# Altium schematic sheet Sheet1.SchDoc
size A2
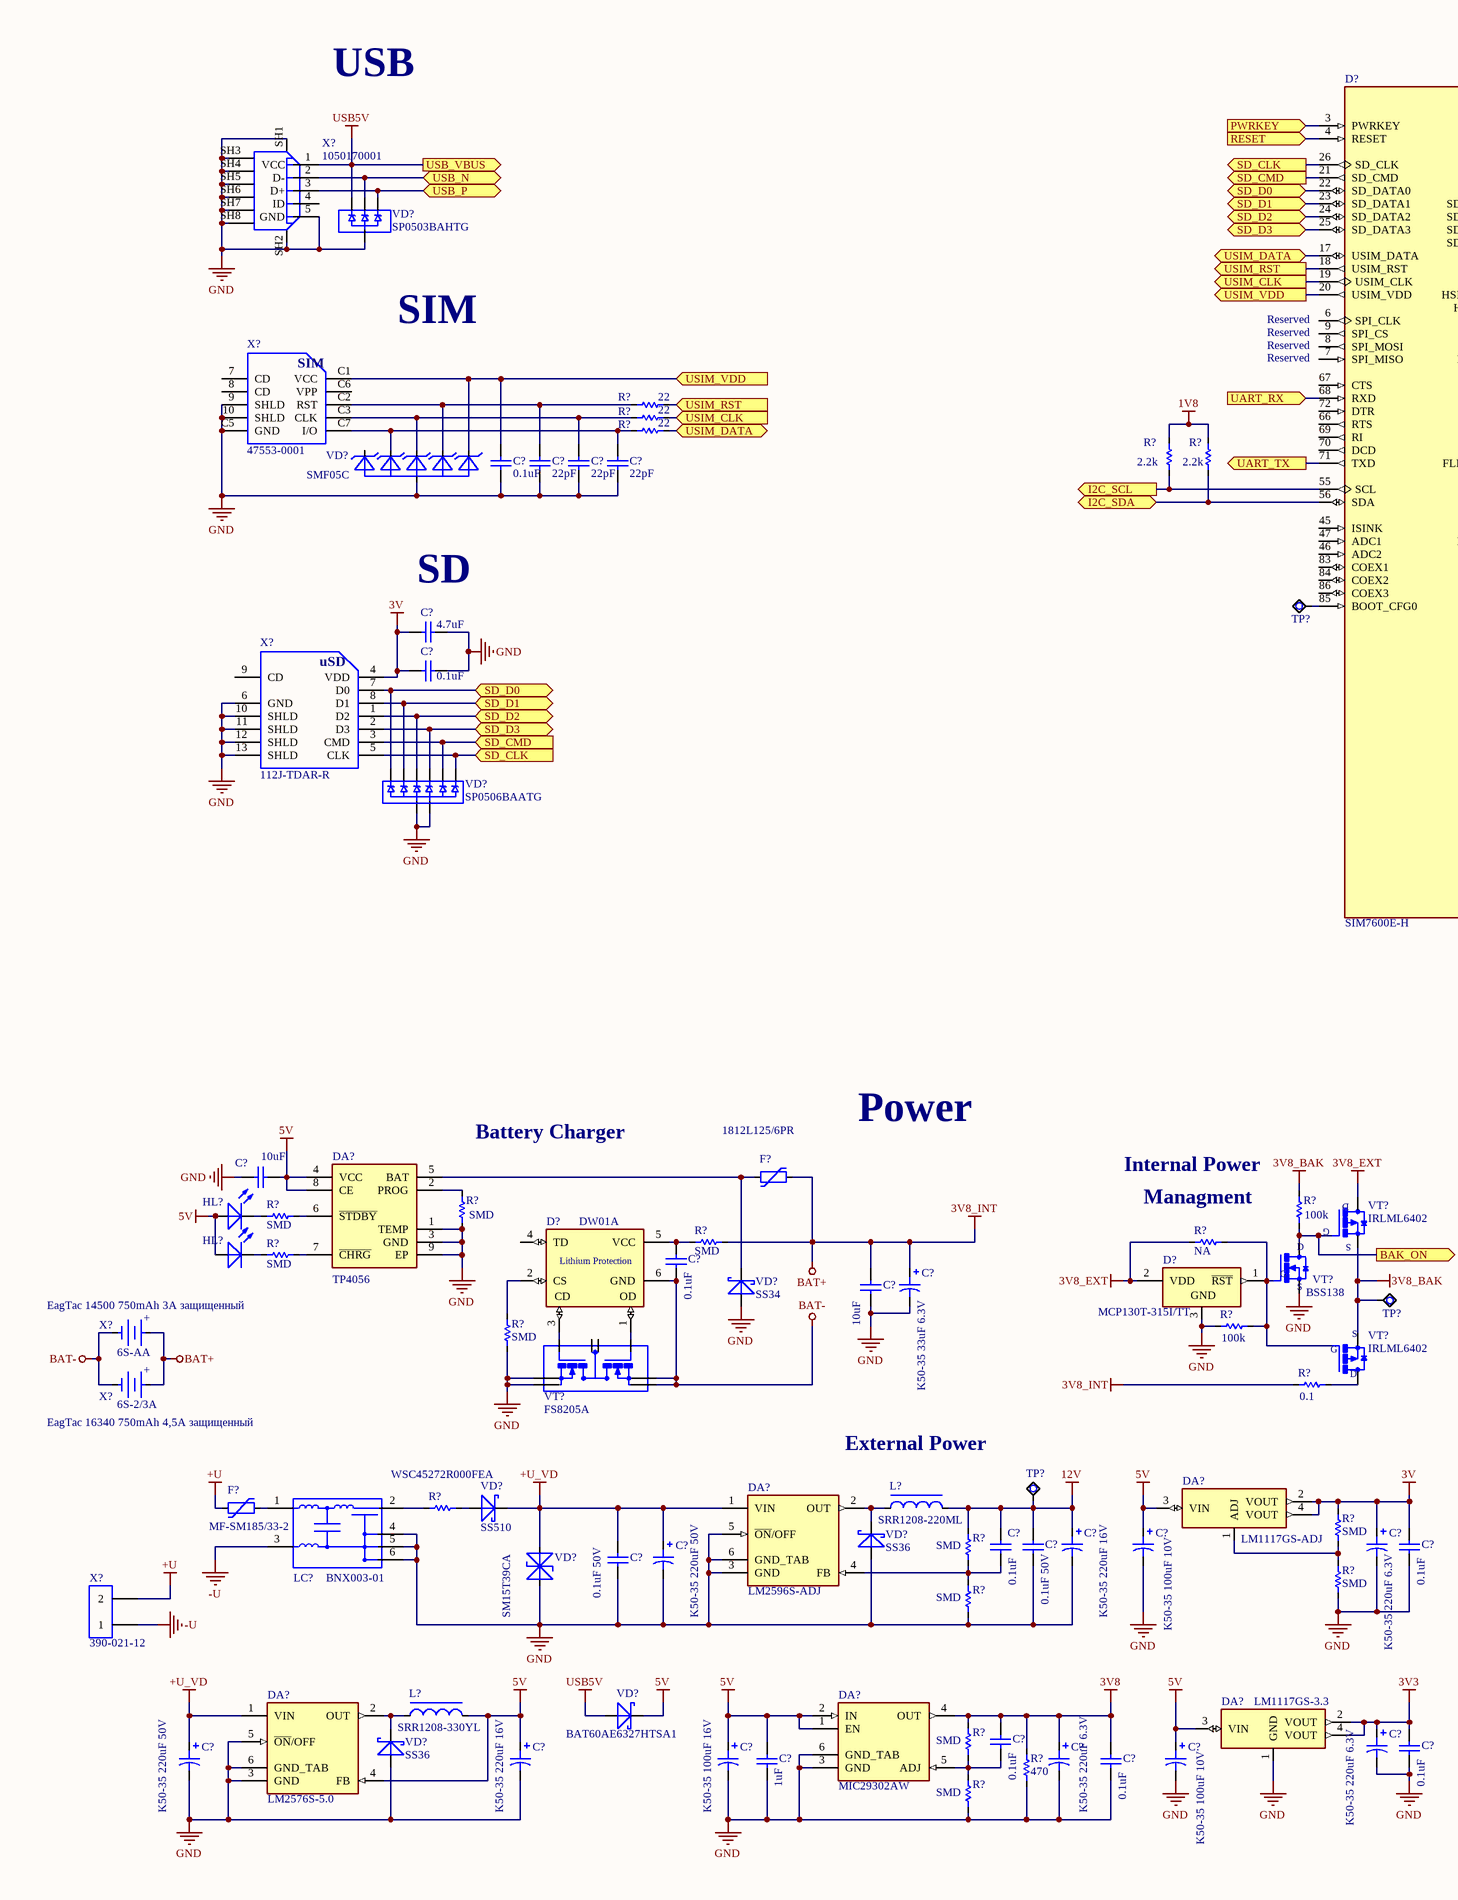
[diagram p0: Sheet1.SchDoc, left]
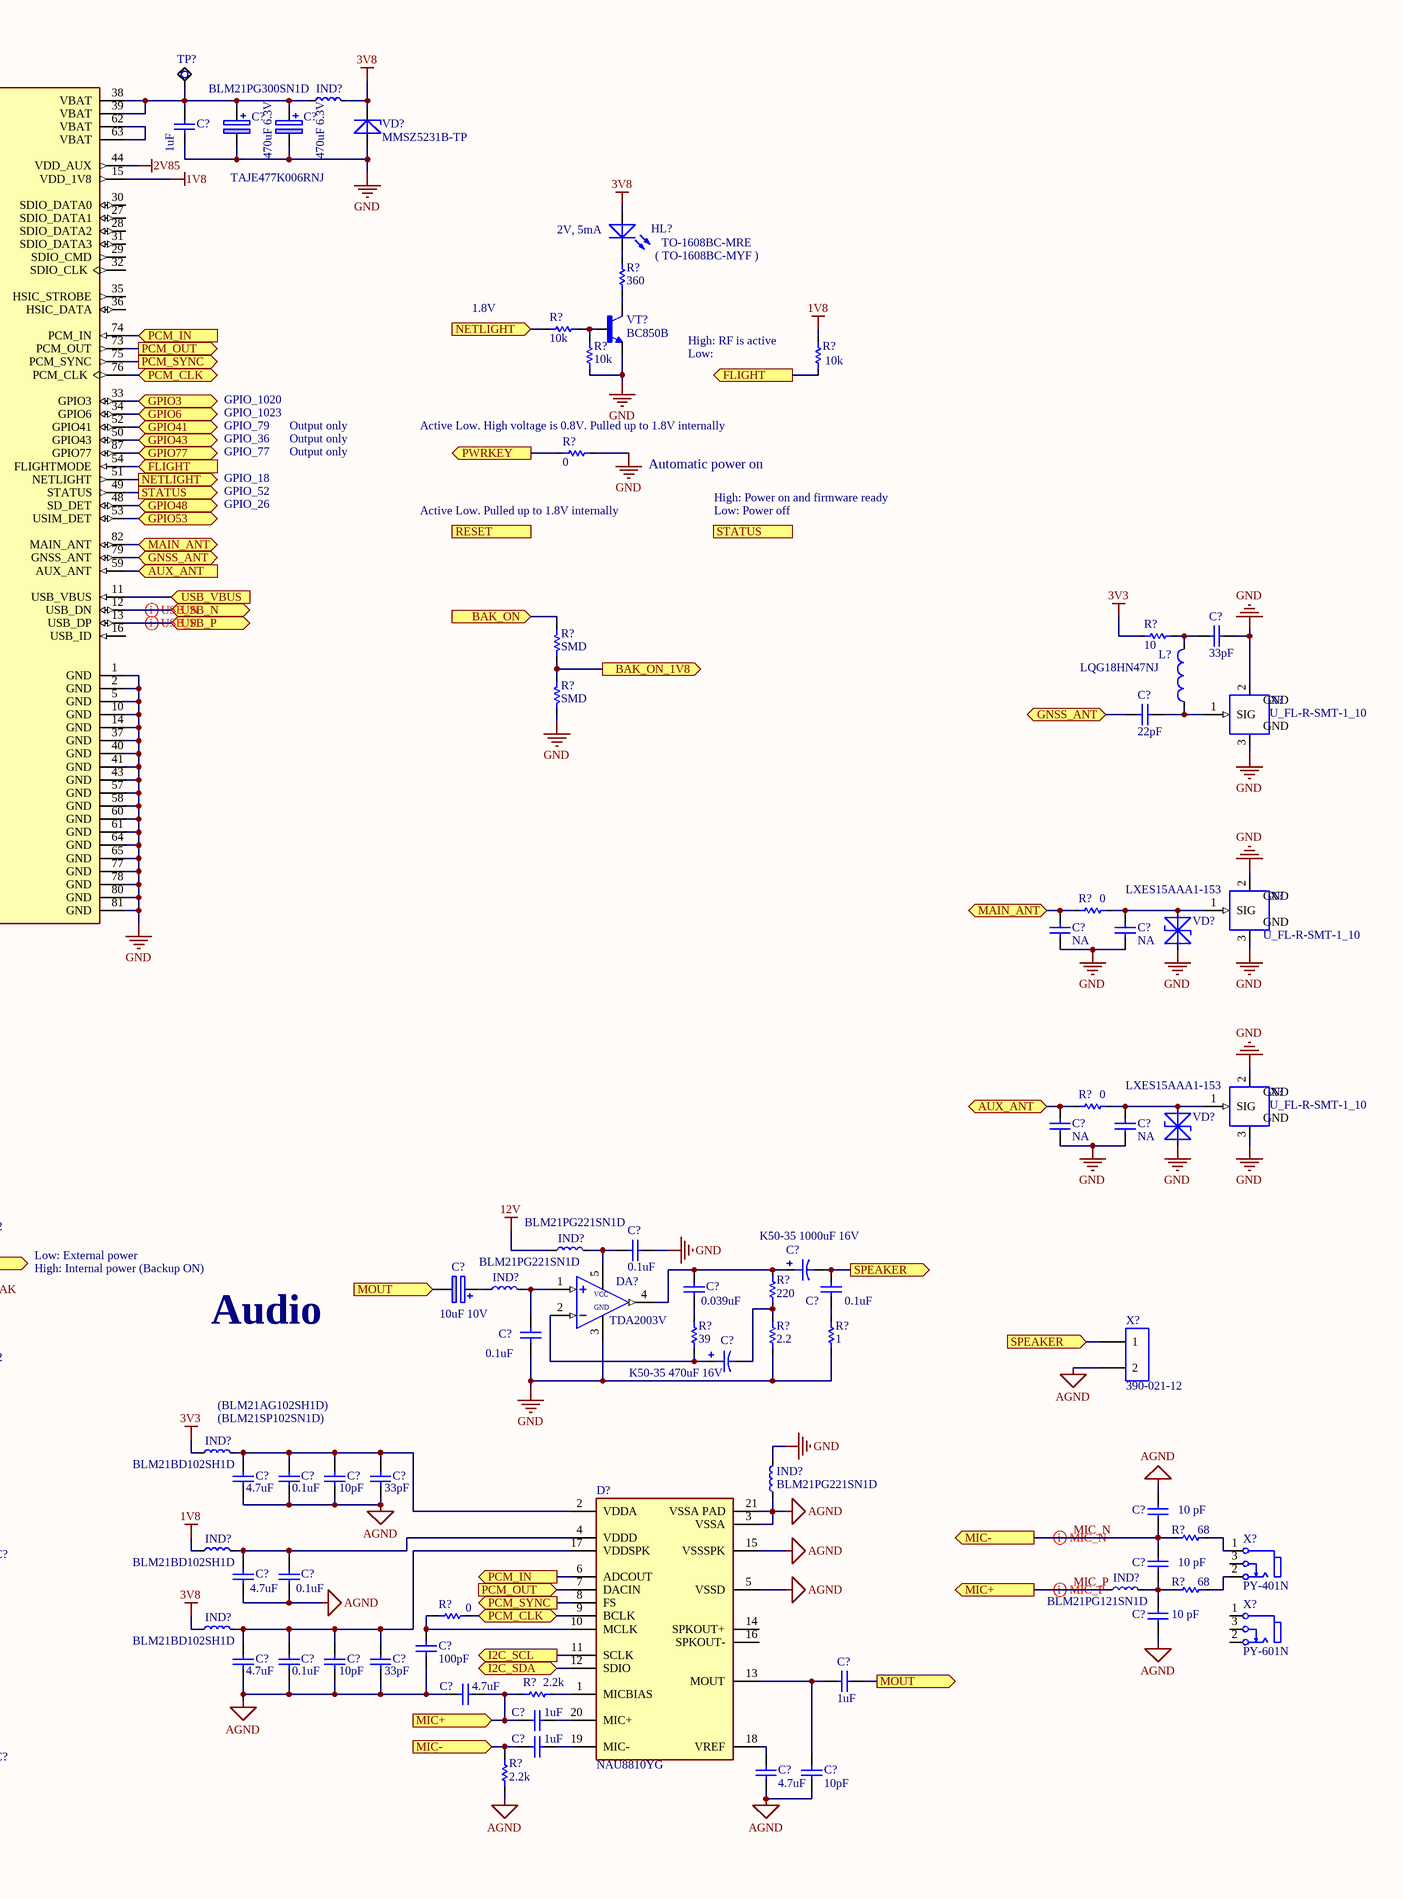
[diagram p1: Sheet1.SchDoc, right]

## Parts
(Parts that share a designator on the sheet are numbered #1, #2 ... from top to bottom, then left to right.)
C?#1  1uF  [C_SMD0603]
C?#2  470uF 6.3V  [TECAP_A]
C?#3  470uF 6.3V  [TECAP_A]
C?#4  0.1uF  [C_SMD0603]
C?#5  22pF  [C_SMD0603]
C?#6  22pF  [C_SMD0603]
C?#7  22pF  [C_SMD0603]
C?#8  33pF  [C_SMD0603]
C?#9  4.7uF  [C_SMD0603]
C?#10  0.1uF  [C_SMD0603]
C?#11  22pF  [C_SMD0603]
C?#12  NA  [C_SMD0603]
C?#13  NA  [C_SMD0603]
C?#14  NA  [C_SMD0603]
C?#15  NA  [C_SMD0603]
C?#16  10uF  [C_SMD0603]
C?#17  0.1uF  [C_SMD0603]
C?#18  0.1uF  [C_SMD0603]
C?#19  0.039uF  [C_SMD0603]
C?#20  K50-35 1000uF 16V  [K50-35 10x12.5x5]
C?#21  0.1uF  [C_SMD0603]
C?#22  10uF  [C_SMD0603]
C?#23  10uF 10V  [TECAP_B]
C?#24  K50-35 33uF 6.3V  [K50-35mini 4x7x2]
C?#25  0.1uF  [C_SMD0603]
C?#26  K50-35 470uF 16V  [K50-35 8x11.5x3.5]
C?#27  4.7uF  [C_SMD0603]
C?#28  0.1uF  [C_SMD0603]
C?#29  10pF  [C_SMD0603]
C?#30  33pF  [C_SMD0603]
C?#31  10 pF  [C_SMD0603]
C?#32  0.1uF  [C_SMD0603]
C?#33  0.1uF 50V  [C_SMD0603]
C?#34  0.1uF  [C_SMD0603]
C?#35  10 pF  [C_SMD0603]
C?#36  0.1uF 50V  [C_SMD0603]
C?#37  4.7uF  [C_SMD0603]
C?#38  0.1uF  [C_SMD0603]
C?#39  K50-35 220uF 16V  [K50-35 6.3x11x2.5]
C?#40  K50-35 100uF 10V  [K50-35 5x11x2]
C?#41  K50-35 220uF 6.3V  [K50-35 6.3x11x2.5]
C?#42  K50-35 220uF 50V  [K50-35 10x12.5x5]
C?#43  10 pF  [C_SMD0603]
C?#44  4.7uF  [C_SMD0603]
C?#45  0.1uF  [C_SMD0603]
C?#46  10pF  [C_SMD0603]
C?#47  33pF  [C_SMD0603]
C?#48  1uF  [C_SMD0603]
C?#49  100pF  [C_SMD0603]
C?#50  4.7uF  [C_SMD0603]
C?#51  0.1uF  [C_SMD0603]
C?#52  0.1uF  [C_SMD0603]
C?#53  1uF  [C_SMD0603]
C?#54  1uF  [C_SMD0603]
C?#55  0.1uF  [C_SMD0603]
C?#56  1uF  [C_SMD0603]
C?#57  K50-35 220uF 6.3V  [K50-35 6.3x11x2.5]
C?#58  K50-35 220uF 50V  [K50-35 10x12.5x5]
C?#59  K50-35 220uF 16V  [K50-35 6.3x11x2.5]
C?#60  K50-35 100uF 16V  [K50-35 6.3x11x2.5]
C?#61  K50-35 220uF 6.3V  [K50-35 6.3x11x2.5]
C?#62  K50-35 100uF 10V  [K50-35 5x11x2]
C?#63  4.7uF  [C_SMD0603]
C?#64  10pF  [C_SMD0603]
D?#1  SIM7600E-H  [IC_SIM7600E-H]
D?#2  DW01A  [SOT23-6-D]
D?#3  MCP130T-315I/TT  [SOT23-3]
D?#4  NAU8810YG  [NAU8810YG]
DA?#1  TP4056  [SOIC127P600X175-9N]
DA?#2  TDA2003V  [TDA2003V]
DA?#3  LM2596S-ADJ  [TO263-5]
DA?#4  LM1117GS-ADJ  [SOT223]
DA?#5  LM2576S-5.0  [TO263-5]
DA?#6  MIC29302AW  [TO-252-5]
DA?#7  LM1117GS-3.3  [SOT223]
F?#1  1812L125/6PR  [FUSSC324X455X62L]
F?#2  MF-SM185/33-2  [FUSM8867X300N]
HL?#1  TO-1608BC-MRE  [LED_SMD1608]
HL?#2  TO-1608BC-MRE  [LED_SMD1608]  (value not drawn)
HL?#3  TO-1608BC-MRE  [LED_SMD1608]  (value not drawn)
IND?#1  BLM21PG300SN1D  [BLM21PG221_0805]
IND?#2  BLM21PG221SN1D  [BLM21PG221_0805]
IND?#3  BLM21PG221SN1D  [BLM21PG221_0805]
IND?#4  BLM21BD102SH1D  [BLM21PG221_0805]
IND?#5  BLM21PG221SN1D  [BLM21PG221_0805]
IND?#6  BLM21BD102SH1D  [BLM21PG221_0805]
IND?#7  BLM21PG121SN1D  [BLM21PG221_0805]
IND?#8  BLM21BD102SH1D  [BLM21PG221_0805]
L?#1  LQG18HN47NJ  [R_SMD0603]
L?#2  SRR1208-220ML  [SRR1208]
L?#3  SRR1208-330YL  [SRR1208]
LC?  BNX003-01  [Murata_BNX_L12MM5_W11MM5_T13MM0_MFG]
R?#1  360  [R_SMD0603]
R?#2  10k  [R_SMD0603]
R?#3  10k  [R_SMD0603]
R?#4  10k  [R_SMD0603]
R?#5  22  [R_SMD0603]
R?#6  22  [R_SMD0603]
R?#7  0  [R_SMD0603]
R?#8  22  [R_SMD0603]
R?#9  2.2k  [R_SMD0603]
R?#10  2.2k  [R_SMD0603]
R?#11  SMD  [R_SMD0603]
R?#12  10  [R_SMD0603]
R?#13  SMD  [R_SMD0603]
R?#14  0  [R_SMD0603]
R?#15  0  [R_SMD0603]
R?#16  SMD  [R_SMD0603]
R?#17  100k  [R_SMD0603]
R?#18  SMD  [R_SMD0603]
R?#19  SMD  [R_SMD0603]
R?#20  NA  [R_SMD0603]
R?#21  SMD  [R_SMD0603]
R?#22  220  [R_SMD0603]
R?#23  39  [R_SMD0603]
R?#24  2.2  [R_SMD0603]
R?#25  1  [R_SMD0603]
R?#26  SMD  [R_SMD0603]
R?#27  100k  [R_SMD0603]
R?#28  0.1  [R_SMD0805]
R?#29  WSC45272R000FEA  [R_SMD4527]
R?#30  68  [R_SMD0603]
R?#31  SMD  [R_SMD0603]
R?#32  SMD  [R_SMD0603]
R?#33  68  [R_SMD0603]
R?#34  SMD  [R_SMD0603]
R?#35  SMD  [R_SMD0603]
R?#36  0  [R_SMD0603]
R?#37  2.2k  [R_SMD0603]
R?#38  SMD  [R_SMD0603]
R?#39  2.2k  [R_SMD0603]
R?#40  470  [R_SMD0805]
R?#41  SMD  [R_SMD0603]
TP?#1  Test_point  [TEST_POINT]  (value not drawn)
TP?#2  Test_point  [TEST_POINT]  (value not drawn)
TP?#3  Test_point  [TEST_POINT]  (value not drawn)
TP?#4  Test_point  [TEST_POINT]  (value not drawn)
VD?#1  MMSZ5231B-TP  [SOD-123_3716X135N]
VD?#2  SP0503BAHTG  [SP0503BAHTG]
VD?#3  SMF05C  [SMF05C]
VD?#4  SP0506BAATG  [SOP65P490X110-8N]
VD?#5  LXES15AAA1-153  [Murata_LXES15_IPC_A]
VD?#6  LXES15AAA1-153  [Murata_LXES15_IPC_A]
VD?#7  SS34  [DO214AB SMC]
VD?#8  SS510  [SMC]
VD?#9  SS36  [DO214AB SMC]
VD?#10  SM15T39CA  [DO214AB SMC]
VD?#11  BAT60AE6327HTSA1  [SOD-323]
VD?#12  SS36  [DO214AB SMC]
VT?#1  BC850B  [SOT23-3]
VT?#2  IRLML6402  [SOT23]
VT?#3  FS8205A  [SOP65P640X120-8N]
VT?#4  BSS138  [SOT23-3]
VT?#5  IRLML6402  [SOT23]
X?#1  1050170001  [MOLEX_1050170001]
X?#2  47553-0001  [Molex_47553-0001_SIM]
X?#3  112J-TDAR-R  [112JTDARR]
X?#4  U_FL-R-SMT-1_10  [HIROSE_0_MFG]
X?#5  U_FL-R-SMT-1_10  [HIROSE_0_MFG]
X?#6  U_FL-R-SMT-1_10  [HIROSE_0_MFG]
X?#7  6S-AA  [BAT_6S-AA]
X?#8  390-021-12  [390-021-12]
X?#9  6S-2/3A  [BAT_6S-2/3A]
X?#10  PY-401N  [PY-401N]
X?#11  PY-601N  [PY601-N]
X?#12  390-021-12  [390-021-12]

## Ports
AUX_ANT (bidir), AUX_ANT (in), BAK_ON (in), BAK_ON (out), BAK_ON_1V8 (out), FLIGHT (in), FLIGHT (out), GNSS_ANT (bidir), GPIO3 (bidir), GPIO6 (bidir), GPIO41 (bidir), GPIO43 (bidir), GPIO48 (bidir), GPIO53 (bidir), GPIO77 (bidir), I2C_SCL (out), I2C_SDA (bidir), MAIN_ANT (bidir), MIC+ (in), MIC+ (out), MIC- (in), MIC- (out), MOUT (in), MOUT (out), NETLIGHT (in), NETLIGHT (out), PCM_CLK (bidir), PCM_IN (in), PCM_IN (out), PCM_OUT (in), PCM_OUT (out), PCM_SYNC (out), PWRKEY (in), PWRKEY (out), RESET (in), RESET (out), SD_CLK (in), SD_CLK (out), SD_CMD (in), SD_CMD (out), SD_D0 (bidir), SD_D1 (bidir), SD_D2 (bidir), SD_D3 (bidir), SPEAKER (in), SPEAKER (out), STATUS (in), STATUS (out), UART_RX (in), UART_TX (out), USB_N (bidir), USB_P (bidir), USB_VBUS (in), USB_VBUS (out), USIM_CLK (in), USIM_CLK (out), USIM_DATA (bidir), USIM_RST (in), USIM_RST (out), USIM_VDD (in), USIM_VDD (out)

## Nets
1V8: D?#1.15(VDD_1V8) IND?#6.1 R?#4.1(CCW) R?#9.2(CW) R?#10.2(CW)
2V85: D?#1.44(VDD_AUX)
3V: C?#9.2 C?#10.2 C?#34.1 C?#41.1 DA?#4.2(VOUT) DA?#4.4(VOUT) R?#31.2(CW) X?#3.4(VDD)
3V3: C?#52.1 C?#57.1 DA?#7.2(VOUT) DA?#7.4(VOUT) IND?#4.1 R?#12.2(CW)
3V8: C?#51.1 C?#55.1 C?#61.1 DA?#6.4(OUT) HL?#1.1(POS) IND?#1.2 IND?#8.1 R?#38.2(CW) R?#40.2(CW) VD?#1.C(NEG)
3V8_BAK: R?#17.1(CCW) TP?#3.1 VT?#2.2(S) VT?#5.2(S)
3V8_EXT: D?#3.2(VDD) R?#20.2(CW) VT?#2.3(D)
3V8_INT: C?#22.1 C?#24.1 F?#1.2 R?#19.1(CCW) R?#28.2(CW) X?#7.POS X?#9.POS  [also labelled BAT+]
5V: C?#16.2 C?#40.1 C?#54.1 C?#59.1 C?#60.1 C?#62.1 DA?#1.4(VCC) DA?#1.8(CE) DA?#4.3(VIN) DA?#5.4(FB) DA?#6.1(EN) DA?#6.2(IN) DA?#7.3(VIN) HL?#2.1(POS) HL?#3.1(POS) L?#3.2 VD?#11.2(NEG)
12V: C?#32.1 C?#33.1 C?#39.1 IND?#2.1 L?#2.2 R?#32.2(CW) TP?#4.1
+U: F?#2.1 X?#12.2
+U_VD: C?#36.1 C?#42.1 C?#58.1 DA?#3.1(VIN) DA?#5.1(VIN) VD?#8.C(NEG) VD?#10.2(K)
-U: LC?.3(PSG) X?#12.1
AGND: C?#27.2 C?#28.2 C?#29.2 C?#30.2 C?#31.1 C?#37.2 C?#38.2 C?#43.2 C?#44.2 C?#45.2 C?#46.2 C?#47.2 C?#49.1 C?#50.1 C?#63.1 C?#64.1 D?#4.3(VSSA) D?#4.5(VSSD) D?#4.15(VSSSPK) D?#4.21(VSSA_PAD) IND?#5.1 R?#39.2(CW) X?#8.2
BAT-: C?#17.2 D?#2.6(GND) VT?#3.2(S1_1) VT?#3.3(S1_2) X?#7.NEG X?#9.NEG
GND: C?#1.2 C?#2.2(-) C?#3.2(-) C?#4.2 C?#5.2 C?#6.2 C?#7.2 C?#8.1 C?#9.1 C?#10.1 C?#12.1 C?#13.1 C?#14.1 C?#15.1 C?#16.1 C?#18.2 C?#22.2 C?#24.2 C?#25.2 C?#33.2 C?#34.2 C?#36.2 C?#39.2 C?#40.2 C?#41.2 C?#42.2 C?#52.2 C?#54.2 C?#55.2 C?#57.2 C?#58.2 C?#59.2 C?#60.2 C?#61.2 C?#62.2 D?#1.1(GND) D?#1.2(GND) D?#1.5(GND) D?#1.10(GND) D?#1.14(GND) D?#1.37(GND) D?#1.40(GND) D?#1.41(GND) D?#1.43(GND) D?#1.57(GND) D?#1.58(GND) D?#1.60(GND) D?#1.61(GND) D?#1.64(GND) D?#1.65(GND) D?#1.77(GND) D?#1.78(GND) D?#1.80(GND) D?#1.81(GND) D?#3.3(VSS) DA?#1.1(TEMP) DA?#1.3(GND) DA?#1.9(EP) DA?#2.3(GND) DA?#3.3(GND) DA?#3.5(~{ON}/OFF) DA?#3.6(GND_TAB) DA?#5.3(GND) DA?#5.5(~{ON}/OFF) DA?#5.6(GND_TAB) DA?#6.3(GND) DA?#6.6(GND_TAB) DA?#7.1(GND) IND?#5.2 LC?.4(CG) LC?.5(CG) LC?.6(CG) R?#3.1(CCW) R?#7.2(CW) R?#13.1(CCW) R?#16.1(CCW) R?#24.2(CW) R?#25.2(CW) R?#26.2(CW) R?#27.2(CW) R?#34.1(CCW) R?#35.1(CCW) R?#40.1(CCW) R?#41.1(CCW) VD?#1.A(POS) VD?#2.1(GND) VD?#3.2(A) VD?#4.1(GND) VD?#4.8(GND) VD?#5.1(A) VD?#6.1(A) VD?#7.1(POS) VD?#9.1(POS) VD?#10.1(A) VD?#12.1(POS) VT?#1.2(E) VT?#3.6(S2_1) VT?#3.7(S2_2) VT?#4.2(S) X?#1.5(GND) X?#1.SH1(SHIELD) X?#1.SH2(SHIELD) X?#1.SH3(SHIELD) X?#1.SH4(SHIELD) X?#1.SH5(SHIELD) X?#1.SH6(SHIELD) X?#1.SH7(SHIELD) X?#1.SH8(SHIELD) X?#2.9(SHLD) X?#2.10(SHLD) X?#2.C5(GND) X?#3.6(GND) X?#3.10(SHLD) X?#3.11(SHLD) X?#3.12(SHLD) X?#3.13(SHLD) X?#4.2(GND) X?#4.3(GND) X?#5.2(GND) X?#5.3(GND) X?#6.2(GND) X?#6.3(GND)
USB5V: D?#1.11(USB_VBUS) VD?#2.2(A) VD?#11.1(POS) X?#1.1(VCC) ; port USB_VBUS
AUX_ANT: C?#14.2 D?#1.59(AUX_ANT) R?#15.1(CCW) ; port AUX_ANT
BAK_ON: R?#11.2(CW) R?#17.2(CW) VT?#2.1(G) VT?#4.3(D) ; port BAK_ON
BAK_ON_1V8: R?#11.1(CCW) R?#13.2(CW) ; port BAK_ON_1V8
FLIGHT: D?#1.54(FLIGHTMODE) R?#4.2(CW) ; port FLIGHT
GNSS_ANT: C?#11.2 D?#1.79(GNSS_ANT) ; port GNSS_ANT
GPIO3: D?#1.33(GPIO3) ; port GPIO3
GPIO6: D?#1.34(GPIO6) ; port GPIO6
GPIO41: D?#1.52(GPIO41) ; port GPIO41
GPIO43: D?#1.50(GPIO43) ; port GPIO43
GPIO48: D?#1.48(SD_DET) ; port GPIO48
GPIO53: D?#1.53(USIM_DET) ; port GPIO53
GPIO77: D?#1.87(GPIO77) ; port GPIO77
I2C_SCL: D?#1.55(SCL) D?#4.11(SCLK) R?#9.1(CCW) ; port I2C_SCL
I2C_SDA: D?#1.56(SDA) D?#4.12(SDIO) R?#10.1(CCW) ; port I2C_SDA
MAIN_ANT: C?#12.2 D?#1.82(MAIN_ANT) R?#14.1(CCW) ; port MAIN_ANT
MIC_N: C?#31.2 C?#35.1 C?#56.1 R?#30.1(CCW) R?#39.1(CCW) ; port MIC-
MIC_P: C?#50.2 C?#53.1 IND?#7.1 R?#37.2(CW) ; port MIC+
MOUT: C?#23.2(-) C?#48.1 ; port MOUT
NETLIGHT: D?#1.51(NETLIGHT) R?#2.1(CCW) ; port NETLIGHT
PCM_CLK: D?#1.76(PCM_CLK) D?#4.9(BCLK) R?#36.1(CCW) ; port PCM_CLK
PCM_IN: D?#1.74(PCM_IN) D?#4.6(ADCOUT) ; port PCM_IN
PCM_OUT: D?#1.73(PCM_OUT) D?#4.7(DACIN) ; port PCM_OUT
PCM_SYNC: D?#1.75(PCM_SYNC) D?#4.8(FS) ; port PCM_SYNC
PWRKEY: D?#1.3(PWRKEY) R?#7.1(CCW) ; port PWRKEY
RESET: D?#1.4(RESET) ; port RESET
SD_CLK: D?#1.26(SD_CLK) VD?#4.7(D) X?#3.5(CLK) ; port SD_CLK
SD_CMD: D?#1.21(SD_CMD) VD?#4.6(B) X?#3.3(CMD) ; port SD_CMD
SD_D0: D?#1.22(SD_DATA0) VD?#4.2(A) X?#3.7(D0) ; port SD_D0
SD_D1: D?#1.23(SD_DATA1) VD?#4.3(C) X?#3.8(D1) ; port SD_D1
SD_D2: D?#1.24(SD_DATA2) VD?#4.4(B) X?#3.1(D2) ; port SD_D2
SD_D3: D?#1.25(SD_DATA3) VD?#4.5(D) X?#3.2(D3) ; port SD_D3
SPEAKER: C?#20.2 C?#21.1 X?#8.1 ; port SPEAKER
STATUS: D?#1.49(STATUS) ; port STATUS
UART_RX: D?#1.68(RXD) ; port UART_RX
UART_TX: D?#1.71(TXD) ; port UART_TX
USB_N: D?#1.12(USB_DN) VD?#2.4(C) X?#1.2(D-) ; port USB_N
USB_P: D?#1.13(USB_DP) VD?#2.3(B) X?#1.3(D+) ; port USB_P
USIM_CLK: D?#1.19(USIM_CLK) R?#6.1(CCW) ; port USIM_CLK
USIM_DATA: D?#1.17(USIM_DATA) R?#8.1(CCW) ; port USIM_DATA
USIM_RST: D?#1.18(USIM_RST) R?#5.1(CCW) ; port USIM_RST
USIM_VDD: C?#4.1 D?#1.20(USIM_VDD) VD?#3.6(C5) X?#2.C1(VCC) ; port USIM_VDD
NetC?#1_1: C?#1.1 C?#2.1(+) C?#3.1(+) D?#1.38(VBAT) D?#1.39(VBAT) IND?#1.1 TP?#1.1
NetC?#5_1: C?#5.1 R?#5.2(CW) VD?#3.5(C4) X?#2.C2(RST)
NetC?#6_1: C?#6.1 R?#6.2(CW) VD?#3.4(C3) X?#2.C3(CLK)
NetC?#7_1: C?#7.1 R?#8.2(CW) VD?#3.3(C2) X?#2.C7(I/O)
NetC?#8_2: C?#8.2 L?#1.2 R?#12.1(CCW)
NetC?#11_1: C?#11.1 L?#1.1 X?#4.1(SIG)
NetC?#13_2: C?#13.2 R?#14.2(CW) VD?#5.2(K) X?#5.1(SIG)
NetC?#15_2: C?#15.2 R?#15.2(CW) VD?#6.2(K) X?#6.1(SIG)
NetC?#17_1: C?#17.1 D?#2.5(VCC) R?#19.2(CW)
NetC?#18_1: C?#18.1 DA?#2.5(VCC) IND?#2.2
NetC?#19_1: C?#19.1 C?#20.1 DA?#2.4(OUT) R?#22.1(CCW)
NetC?#19_2: C?#19.2 R?#23.1(CCW)
NetC?#21_2: C?#21.2 R?#25.1(CCW)
NetC?#23_1: C?#23.1(+) IND?#3.1
NetC?#25_1: C?#25.1 DA?#2.1(+IN) IND?#3.2
NetC?#26_1: C?#26.1 DA?#2.2(-IN) R?#23.2(CW)
NetC?#26_2: C?#26.2 R?#22.2(CW) R?#24.1(CCW)
NetC?#27_1: C?#27.1 C?#28.1 C?#29.1 C?#30.1 D?#4.2(VDDA) IND?#4.2
NetC?#32_2: C?#32.2 DA?#3.4(FB) R?#32.1(CCW) R?#35.2(CW)
NetC?#35_2: C?#35.2 C?#43.1 IND?#7.2 R?#33.1(CCW)
NetC?#37_1: C?#37.1 C?#38.1 D?#4.4(VDDD) IND?#6.2
NetC?#44_1: C?#44.1 C?#45.1 C?#46.1 C?#47.1 D?#4.17(VDDSPK) IND?#8.2
NetC?#48_2: C?#48.2 C?#64.2 D?#4.13(MOUT)
NetC?#49_2: C?#49.2 D?#4.10(MCLK) R?#36.2(CW)
NetC?#51_2: C?#51.2 DA?#6.5(ADJ) R?#38.1(CCW) R?#41.2(CW)
NetC?#53_2: C?#53.2 D?#4.20(MIC+)
NetC?#56_2: C?#56.2 D?#4.19(MIC-)
NetC?#63_2: C?#63.2 D?#4.18(VREF)
NetD?#1_62: D?#1.62(VBAT) D?#1.63(VBAT)
NetD?#1_85: D?#1.85(BOOT_CFG0) TP?#2.1
NetD?#2_1: D?#2.1(OD) VT?#3.4(G1)
NetD?#2_2: D?#2.2(CS) R?#26.1(CCW)
NetD?#2_3: D?#2.3(OC) VT?#3.5(G2)
NetD?#3_1: D?#3.1(~{RST}) R?#20.1(CCW) R?#27.1(CCW) VT?#4.1(G) VT?#5.1(G)
NetD?#4_1: D?#4.1(MICBIAS) R?#37.1(CCW)
NetDA?#1_2: DA?#1.2(PROG) R?#16.2(CW)
NetDA?#1_5: DA?#1.5(BAT) F?#1.1 VD?#7.2(NEG)
NetDA?#1_6: DA?#1.6(~{STDBY}) R?#18.1(CCW)
NetDA?#1_7: DA?#1.7(~{CHRG}) R?#21.1(CCW)
NetDA?#3_2: DA?#3.2(OUT) L?#2.1 VD?#9.2(NEG)
NetDA?#4_1: DA?#4.1(ADJ) R?#31.1(CCW) R?#34.2(CW)
NetDA?#5_2: DA?#5.2(OUT) L?#3.1 VD?#12.2(NEG)
NetF?#2_2: F?#2.2 LC?.1(B)
NetHL?#1_2: HL?#1.2(NEG) R?#1.2(CW)
NetHL?#2_2: HL?#2.2(NEG) R?#18.2(CW)
NetHL?#3_2: HL?#3.2(NEG) R?#21.2(CW)
NetLC?_2: LC?.2(CB) R?#29.1(CCW)
NetR?#1_1: R?#1.1(CCW) VT?#1.3(C)
NetR?#2_2: R?#2.2(CW) R?#3.2(CW) VT?#1.1(B)
NetR?#28_1: R?#28.1(CCW) VT?#5.3(D)
NetR?#29_2: R?#29.2(CW) VD?#8.A(POS)
NetR?#30_2: R?#30.2(CW) X?#10.1
NetR?#33_2: R?#33.2(CW) X?#10.2

Not connected (* = marked no-connect by the designer): D?#1 6(SPI_CLK) 7(SPI_MISO) 8(SPI_MOSI) 9(SPI_CS) 16(USB_ID) 27(SDIO_DATA1) 28(SDIO_DATA2) 29(SDIO_CMD) 30(SDIO_DATA0) 31(SDIO_DATA3) 32(SDIO_CLK) 35(HSIC_STROBE) 36(HSIC_DATA) 45(ISINK) 46(ADC2) 47(ADC1) 66(RTS) 67(CTS) 69(RI) 70(DCD) 72(DTR) 83(COEX1) 84(COEX2) 86(COEX3); D?#2 4(TD); D?#4 14(SPKOUT+) 16(SPKOUT-); VD?#3 1(C1); VT?#3 1(D12_1) 8(D12_2); X?#1 4(ID); X?#2 7(CD) 8(CD) C6(VPP); X?#3 9(CD); X?#10 3; X?#11 1 2 3

## Layout directives
differential pair: MIC_N, MIC_P, USB_N, USB_P

## Notes on the sheet
- USB
- (near C?#2) TAJE477K006RNJ
- 2V, 5mA
- (near D?#1) Reserved
- 1.8V
- ( TO-1608BC-MYF )
- SIM
- (near R?#4) High: RF is active
- Low:
- GPIO_1020
- GPIO_1023
- GPIO_79
- GPIO_36
- GPIO_77
- Output only
- (near R?#7) Active Low. High voltage is 0.8V. Pulled up to 1.8V internally
- GPIO_18
- GPIO_26
- GPIO_52
- Active Low. Pulled up to 1.8V internally
- Automatic power on
- High: Power on and firmware ready
- Low: Power off
- (near C?#9) SD
- Battery Charger
- Power
- (near R?#17) Internal Power
- (near R?#20) Managment
- Low: External power
- High: Internal power (Backup ON)
- (near X?#7) EagTac 14500 750mAh 3А защищенный
- Audio
- (near IND?#4) (BLM21SP102SN1D)
- (BLM21AG102SH1D)
- (near X?#9) EagTac 16340 750mAh 4,5А защищенный
- External Power
- Title
- Size:
- Date:
- File:
- A2
- Number:
- Time:
- Revision:
- Sheet
- of
- (in symbol 14500 Battery Holder (AA)) +
- (in symbol 16340 Battery Holder) +
- (in symbol DW01A) Lithium Protection; CD
- (in symbol MCP130T-315I/TT) GND
- (in symbol microSD_112J-TDAR-R) uSD
- (in symbol SIM_Holder_47553-0001) SIM

## Library data of the parts
C?#1 C?#4-C?#19 C?#21 C?#22 C?#25 C?#27-C?#38 C?#43-C?#56 C?#63 C?#64 = C_SMD: SMD Capacitor
  C?#19: ComponentLink1Description: chipdip; ComponentLink1URL: https://www.chipdip.ru/product0/8160066189?from=suggest_product; ComponentLink2Description: elitan; ComponentLink2URL: https://www.elitan.ru/price/item8778633
C?#2 C?#3 C?#23 = C_SMD_Tantalum: Конденсатор танталовый SMD; ComponentLink1Description: 470uF-10V-chipdip; ComponentLink1URL: https://www.chipdip.ru/product0/145634327?from=suggest_product
  C?#23: ComponentLink2Description: 470uF-6.3V-elitan; ComponentLink2URL: https://www.elitan.ru/price/item936861; ComponentLink3Description: 10uF-10V-B-chipdip; ComponentLink3URL: https://www.chipdip.ru/product0/146061461?from=suggest_product
C?#20 C?#24 C?#26 C?#39-C?#42 C?#57-C?#62 = K50-35: Конденсатор электролитический алюминиевый
  C?#20: ComponentLink1Description: (К50-35 мини), 220 мкФ, 6.3 В, 6.3х7мм; ComponentLink1URL: https://www.chipdip.ru/product0/9000261774?from=suggest_product; ComponentLink2Description: 1000мкФ, 16В; ComponentLink2URL: https://www.chipdip.ru/product0/9000565923?from=suggest_product
  C?#24 C?#41 C?#57 C?#61: ComponentLink1Description: (К50-35 мини), 220 мкФ, 6.3 В, 6.3х7мм; ComponentLink1URL: https://www.chipdip.ru/product0/9000261774?from=suggest_product
  C?#26: ComponentLink1Description: (К50-35 мини), 220 мкФ, 6.3 В, 6.3х7мм; ComponentLink1URL: https://www.chipdip.ru/product0/9000261774?from=suggest_product; ComponentLink2Description: 470мкФ, 16В; ComponentLink2URL: https://www.chipdip.ru/product0/9000565914
  C?#40 C?#62: ComponentLink1Description: К50-35 мини, 220 мкФ, 6.3 В, 6.3х7мм; ComponentLink1URL: https://www.chipdip.ru/product0/9000261774?from=suggest_product; ComponentLink2Description: К50-35 мини, 100 мкФ, 10 В, 5х7мм; ComponentLink2URL: https://www.chipdip.ru/product0/46079?from=suggest_product
D?#1 = SIM7600E-H: Multi-Band LTE-TDD/LTE-FDD/HSPA+ and GSM/GPRS/EDGE module; MF: Simcom; MP: SIM7600E-H; Availability: Unavailable; Package: None; Value: *; Price: None; SnapEDA_Link: https://www.snapeda.com/parts/SIM7600E-H/SIMcom%20Wireless%20solutions%20Co.%2CLtd/view-part/2758290/?ref=snap
D?#2 = DW01A: Pushbutton Switch SPST-NC Standard Panel Mount, Front; MF: Fortune Semiconductor; Price: None; Availability: Unavailable; Package: Package Analog Devices; SnapEDA_Link: https://www.snapeda.com/parts/DW01A/Fortune%20Semiconductor/view-part/4388554/?ref=snap; MP: DW01A; Value: *; ComponentLink1Description: elitan; ComponentLink1URL: https://www.elitan.ru/price/item379006536
D?#3 = MCP130T-315I/TT: 3.15 V 150 ms Microcontroller Supervisory Circuit - SOT-23-3; MF: Microchip; Value: *; Availability: Unavailable; Price: None; MP: MCP130T-315I/TT; Package: SOT-23 Microchip; SnapEDA_Link: https://www.snapeda.com/parts/MCP130T-315I/TT/Microchip/view-part/12206/?ref=snap; ComponentLink1Description: chipdip; ComponentLink1URL: https://www.chipdip.ru/product0/8002395837
D?#4 = NAU8810YG: AUDIO CODEC MONO 20QFN; Manufacturer: Nuvoton Technology Corporation; Voltage: 3.6V; helpURL: https://upverter.com/upn/revision/eec1ccdac07fe113/; ComponentLink2Description: Datasheet; Temperature: -40°C to +85°C; Package: QFN20; Supplier 2: Mouser; Supplier 1: Digi-Key; ComponentLink1URL: https://upverter.com/upn/revision/eec1ccdac07fe113/; Supplier Part Number 1: NAU8810YG-ND; ComponentLink1Description: Upverter; ComponentLink2URL: http://www.nuvoton.com/hq/resource-download.jsp?tp_GUID=DA00-NAU8810.1; RoHS: TRUE; Ipc Land Pattern Name: QFN50P400X400X75-20; Temperature Range High: +85°C; Digikey Description: IC AUDIO CODEC MONO 20QFN; Digikey Part Number: NAU8810YG-ND; Lead Free: yes; Temperature Range Low: -40°C; ComponentLink3Description: elitan; ComponentLink3URL: https://www.elitan.ru/price/index.php?find=NAU8810YG&delay=-1&mfg=all&seenform=y
DA?#1 = TP4056: Li-lon Battery Charger  1A Standalone Linear with Thermal Regulation in SOP-8; Manufacturer_Name: NanJing Top Power; Datasheet Link: https://dlnmh9ip6v2uc.cloudfront.net/datasheets/Prototyping/TP4056.pdf; Height: 1.75mm; Manufacturer_Part_Number: TP4056; ComponentLink1Description: elitan; ComponentLink1URL: https://www.elitan.ru/price/item26170288
DA?#2 = TDA2003V: Amplifier IC 1-Channel _Mono_ Class AB 5-PENTAWATT 10W; MF: STMicroelectronics; Price: None; Availability: Unavailable; Package: Pentawatt-5 STMicroelectronics; MP: TDA2003V; Value: *; SnapEDA_Link: https://www.snapeda.com/parts/TDA2003V/STMicroelectronics/view-part/39407/?ref=snap; ComponentLink1Description: elitan; ComponentLink1URL: https://www.elitan.ru/price/item123031; ComponentLink2Description: chipdip; ComponentLink2URL: https://www.chipdip.ru/product/tda2003v?from=suggest_product
DA?#3 = LM2596S: SIMPLE SWITCHER&#174; 4.5V to 40V, 3A Low Component Count Step-Down Regulator; ComponentLink1Description: chipdip; ComponentLink1URL: https://www.chipdip.ru/product1/8002950975?from=suggest_product; ComponentLink2Description: elitan; ComponentLink2URL: https://www.elitan.ru/price/item483504; ComponentLink3Description: adj-elitan; ComponentLink3URL: https://www.elitan.ru/price/item100231; ComponentLink4Description: adj-chipdip; ComponentLink4URL: https://www.chipdip.ru/product/lm2596s-adj-nopb
DA?#4 = LM1117GS-ADJ: LDO +1.25...13.8 В, 1А [SOT-223] / Линейный регулятор с низким падением напряжения, Максимальное входное напряжение, 20 В; ComponentLink1Description: chipdip; ComponentLink1URL: https://www.chipdip.ru/product/lm1117gs-adj; ComponentLink2Description: elitan; ComponentLink2URL: https://www.elitan.ru/price/item21580115
DA?#5 = LM2576S: Импульсный понижающий регулятор напряжения, 5В, 3А, [TO-263]; ComponentLink1Description: 5V-shipdip; ComponentLink1URL: https://www.chipdip.ru/product/lm2576sx-5.0-nopb; ComponentLink2Description: 5V-elitan; ComponentLink2URL: https://www.elitan.ru/price/item100181
DA?#6 = MIC29302AW: 3A Fast Response LDO Regulator / Operating Input Voltage Range: 3V to 16V / 1.24V to 15V Adjustable Output Voltage; ComponentLink1Description: elitan; ComponentLink1URL: https://www.elitan.ru/price/item10505092; ComponentLink2Description: chipdip; ComponentLink2URL: https://www.chipdip.ru/product1/8002989812
DA?#7 = LM1117GS-3.3: LDO +3.3 В, 1А [SOT-223] / Линейный регулятор с низким падением напряжения, Максимальное входное напряжение, 20 В; ComponentLink1Description: chipdip; ComponentLink1URL: https://www.chipdip.ru/product/lm1117gs-3.3; ComponentLink2Description: elitan; ComponentLink2URL: https://www.elitan.ru/price/item21580113
F?#1 = 1812L125/6PR: Предохранитель SMD 6 VDC 2.5 A; ComponentLink1Description: elitan; ComponentLink1URL: https://www.elitan.ru/price/item387111
F?#2 = MF-SM185/33-2: Самовосстанавливающийся предохранитель PTC 1.8A(hold) 3.6A(trip) 33VDC 40A 1.9W 5s 0.04Ohm SMD 3425 Solder Pad 9.5 X 6.71 X 3mm; ComponentLink1Description: elitan; ComponentLink1URL: https://www.elitan.ru/price/item781521; ComponentLink2Description: chipdip; ComponentLink2URL: https://www.chipdip.ru/product0/8001787493?from=suggest_product
HL?#1-HL?#3 = LED_SMD: Vf =2 V, 20mA, 0603 / TO-1608BC-BF \  TO-1608BC-MRE; ComponentLink1Description: red-chipdip; ComponentLink1URL: https://www.chipdip.ru/product/to-1608bc-mre?from=suggest_product; ComponentLink2Description: green-chipdip; ComponentLink2URL: https://www.chipdip.ru/product/to-1608bc-pg?from=suggest_product; ComponentLink3Description: blue-chipdip; ComponentLink3URL: https://www.chipdip.ru/product/to-1608bc-bf?from=suggest_product; ComponentLink4Description: yellow-chipdip; ComponentLink4URL: https://www.chipdip.ru/product/to-1608bc-myf?from=suggest_product; ComponentLink5Description: red-elitan; ComponentLink5URL: https://www.elitan.ru/price/item16986056
IND?#1-IND?#8 = BLM21PG221SN1D: 0805, Дроссель подавления ЭМП; ComponentLink1Description: chipdip; ComponentLink1URL: https://www.chipdip.ru/product/blm21pg221sn1d; ComponentLink2Description: pdf-reference; ComponentLink2URL: https://ru.mouser.com/datasheet/2/281/ENFA0005-1485072.pdf
  IND?#1: ComponentLink3Description: 30ohm-chipdip; ComponentLink3URL: https://www.chipdip.ru/product/blm21pg300sn1d; ComponentLink4Description: 30ohm-elitan; ComponentLink4URL: https://www.elitan.ru/price/item310735
  IND?#4 IND?#6 IND?#8: ComponentLink3Description: 30ohm-chipdip; ComponentLink3URL: https://www.chipdip.ru/product/blm21pg300sn1d; ComponentLink4Description: 30ohm-elitan; ComponentLink4URL: https://www.elitan.ru/price/item310735; ComponentLink5Description: 1k-200mA-elitan; ComponentLink5URL: https://www.elitan.ru/price/item975836; ComponentLink6Description: 1k-1.6A-chipdip; ComponentLink6URL: https://www.chipdip.ru/product/blm21sp102sn1d
  IND?#7: ComponentLink3Description: 120ohm-3A-chipdip; ComponentLink3URL: https://www.chipdip.ru/product0/8228217893; ComponentLink4Description: 120ohm-3A-elitan; ComponentLink4URL: https://www.elitan.ru/price/item1364359
L?#1 = LQG18HN47NJ: Чип индуктивность многослойная неэкранированная 47нГн 5% 100МГц / Maximum DC Current 300 mA / Maximum DC Resistance 700 mOhms; ComponentLink1Description: elitan; ComponentLink1URL: https://www.elitan.ru/price/item307313; ComponentLink2Description: chipdip; ComponentLink2URL: https://www.chipdip.ru/product/lqg18hn47nj?from=suggest_product
L?#2 L?#3 = SRR1208-330YL: SMD индуктивность проволочная, на ферритовом сердечнике, экранированная 33uH 15% 1KHz 23Q-Factor Ferrite 2.8A 62mOhm; ComponentLink1Description: chipdip; ComponentLink1URL: https://www.chipdip.ru/product/srr1208-330yl?from=suggest_product; ComponentLink2Description: elitan; ComponentLink2URL: https://www.elitan.ru/price/item319349
  L?#2: ComponentLink3Description: 22uH-elitan; ComponentLink3URL: https://www.elitan.ru/price/item437369
LC? = BNX003-01: EMI фильтр индуктивно-емкостной 10A 150VDC 40дБ; ComponentLink1Description: elitan; ComponentLink1URL: https://www.elitan.ru/price/item279156; ComponentLink2Description: chipdip; ComponentLink2URL: https://www.chipdip.ru/product/bnx003-01?from=suggest_product
R?#1-R?#28 R?#30-R?#41 = R_SMD: SMD Resistor
R?#29 = WSC45272R000FEA: SMD чип резистор, с проволочной обмоткой, 4527, 2 Ом, Серия WSC, 2 Вт; ComponentLink1Description: chipdip; ComponentLink1URL: https://www.chipdip.ru/product/wsc45272r000fea?from=suggest_product; ComponentLink2Description: elitan; ComponentLink2URL: https://www.elitan.ru/price/item572273
TP?#1-TP?#4 = Test_point: Test point for PCB
VD?#1 = MMSZ5231B-TP: Стабилитрон 5.1В, 5%, 0.5Вт, [SOD-123]; ComponentLink1Description: chipdip; ComponentLink1URL: https://www.chipdip.ru/product/mmsz5231b-tp?from=suggest_product
VD?#2 = SP0503BAHTG: TVS Diode-3
VD?#3 = SMF05C: 12.5V Clamp 8A _8/20Âµs_ Ipp Tvs Diode Surface Mount SC-88/SC70-6/SOT-363; MF: ON Semiconductor; Availability: Unavailable; Price: None; Package: SOT-363 ON Semiconductor; Value: *; SnapEDA_Link: https://www.snapeda.com/parts/SMF05C/ON%20Semiconductor/view-part/2782704/?ref=snap; MP: SMF05C
VD?#4 = SP0506BAATG: TVS Diode-6 Clamping Voltage Vc Max:8V; MSOP8, Operating Voltage:5.5V;; ComponentLink1Description: elitan; ComponentLink1URL: https://www.elitan.ru/price/item559579; ComponentLink2Description: chipdip; ComponentLink2URL: https://www.chipdip.ru/product0/8004936449
VD?#5 VD?#6 = LXES15AAA1-153: TVS диоды Подавители ЭСР / диоды для подавления переходных скачков напряжения ESD Protection Device; ComponentLink1Description: chipdip; ComponentLink1URL: https://www.chipdip.ru/product0/8001818635?from=suggest_product; ComponentLink2Description: elitan; ComponentLink2URL: https://www.elitan.ru/price/item11962267
VD?#7 = SS34: Schottky; DO-214AB; 3.0A IF; 0.75V; 40V; 100A IFRM; 10000V/us; 1000pF; ComponentLink1Description: chipdip; ComponentLink1URL: https://www.chipdip.ru/product/ss34-5; ComponentLink2Description: elitan; ComponentLink2URL: https://www.elitan.ru/price/item9505516
VD?#8 = SS510: Диод Шоттки 5A 100V (SMC); ComponentLink1Description: chipdip; ComponentLink1URL: https://www.chipdip.ru/product0/8002382677?from=suggest_product; ComponentLink2Description: elitan; ComponentLink2URL: https://www.elitan.ru/price/item24826922
VD?#9 VD?#12 = SS36: Schottky; DO-214AB; 3.0A IF; 0.75V; 60V; 100A IFRM; 10000V/us; 1000pF; ComponentLink1Description: elitan; ComponentLink1URL: https://www.elitan.ru/price/item15648528; ComponentLink2Description: chipdip; ComponentLink2URL: https://www.chipdip.ru/product/ss36-e3-57t-2?from=suggest_product
VD?#10 = SM15T39CA: TVS Diode Bi-Directional SM15T39CA 69.7V, 1500W, SMC 2-Pin; ComponentLink1Description: chipdip; ComponentLink1URL: https://www.chipdip.ru/product/sm15t39ca?from=suggest_product; ComponentLink2Description: elitan; ComponentLink2URL: https://www.elitan.ru/price/item636974
VD?#11 = BAT60AE6327HTSA1: Диод Шоттки 3А 10В [SOD-323]; ComponentLink1Description: chipdip; ComponentLink1URL: https://www.chipdip.ru/product/bat60a?from=suggest_product; ComponentLink2Description: elitan; ComponentLink2URL: https://www.elitan.ru/price/item9533309
VT?#1 = BC850B: Transistor, Npn, 0.1A, 50V, Vbe = 0.7V, hfe = 240 [ SOT23 ]; ComponentLink1Description: chipdip; ComponentLink1URL: https://www.chipdip.ru/product/bc850b?from=suggest_product
VT?#2 VT?#5 = IRLML6402: P-Channel 20V 3.7A _Ta_ 1.3W _Ta_ Surface Mount Micro3â„¢/SOT-23; MF: Infineon Technologies; Package: SC-59 Infineon Technologies; Value: *; Availability: Unavailable; SnapEDA_Link: https://www.snapeda.com/parts/IRLML6402/Infineon%20Technologies/view-part/2522811/?ref=snap; Price: None; MP: IRLML6402; ComponentLink1Description: chipdip; ComponentLink1URL: https://www.chipdip.ru/product/irlml6402tr?from=suggest_product
VT?#3 = FS8205A: 20V 6A DUAL N-Channel MOSFET Transistor; Manufacturer_Name: SII Semiconductor; Datasheet Link: http://www.ic-fortune.com/upload/Download/FS8205A-DS-12_EN.pdf; Height: 1.2mm; Manufacturer_Part_Number: FS8205A; ComponentLink1Description: elitan; ComponentLink1URL: https://www.elitan.ru/price/item13487239
VT?#4 = BSS138: MOSFET, N-канал, 0.2А, 50В, [SOT-23]; ComponentLink1Description: chipdip; ComponentLink1URL: https://www.chipdip.ru/product/bss138-7-f-diodes?from=suggest_product; ComponentLink2Description: elitan; ComponentLink2URL: https://www.elitan.ru/price/item305174
X?#1 = microUSB_1050170001: USB - micro B USB 2.0 Receptacle Connector 5 Position Surface Mount, Right Angle; Through Hole; MF: Molex; Digi-Key_Purchase_URL: https://www.digikey.com/product-detail/en/molex/1050170001/WM1399CT-ND/2350885?utm_source=snapeda&utm_medium=aggregator&utm_campaign=symbol; Digi-Key_Part_Number: WM1399CT-ND; Package: None; SnapEDA_Link: https://www.snapeda.com/parts/1050170001/Molex/view-part/2755530/?ref=snap; MP: 1050170001; Value: *; ComponentLink1Description: elitan; ComponentLink1URL: https://www.elitan.ru/price/item5116026; ComponentLink2Description: chipdip; ComponentLink2URL: https://www.chipdip.ru/product/105017-0001-molex?utm_source=google&utm_medium=cpc&position_type={position_type}|k50id|pla-293946777986|cid|11945324864|aid|488785225626|gid|115765259517&utm_campaign=G_tovarnieobjavlenija&utm_content=text1_ga&utm_term=
X?#2 = SIM_Holder_47553-0001: 1.27mm Pitch SIM Card Holder with 2 Detect Pins, 6 Circuits, Push-Push Style, / Housing Height 1.80mm, without Pegs, Lead-Free; ComponentLink1Description: Info; ComponentLink1URL: https://www.molex.com/molex/products/part-detail/memory_card_socket/0475530001; ComponentLink2Description: elitan; ComponentLink2URL: https://www.elitan.ru/price/item5698087
X?#3 = microSD_112J-TDAR-R: Разъем: для карт памяти; SD Micro; push-push; SMT; позолота; Manufacturer_Name: ATTEND; Datasheet Link: https://sds.compel.ru/item-pdf/04106748b1d2c9285eaa335c34b51c16/ps/attend~112j-tdar-r.pdf; Height: 1mm; Manufacturer_Part_Number: 112J-TDAR-R; ComponentLink1Description: chipdir; ComponentLink1URL: https://www.chipdip.ru/product0/8002703228; ComponentLink2Description: elitan; ComponentLink2URL: https://www.elitan.ru/price/item10898530; ComponentLink3Description: pdf; ComponentLink3URL: https://sds.compel.ru/item-pdf/04106748b1d2c9285eaa335c34b51c16/ps/attend~112j-tdar-r.pdf
X?#4-X?#6 = U_FL-R-SMT-1_10: Разъем РЧ / 50 Ом Коаксиальный, UFL Коаксиальный, Прямое Гнездо, Вертикальный Поверхностный Монтаж SMT; ComponentLink1Description: elitan; ComponentLink1URL: https://www.elitan.ru/price/item1203541; ComponentLink2Description: chipdip; ComponentLink2URL: https://www.chipdip.ru/product0/9000586248?from=suggest_product
X?#7 = 14500 Battery Holder (AA): 14500 (AA) BATTERY HOLDER PC PIN / 6S-AA / BHAA-POL / BHAA-3-G; ComponentLink1Description: 6S_AA-elitan; ComponentLink1URL: https://www.elitan.ru/price/item10505404; ComponentLink2Description: battery_holders; ComponentLink2URL: https://www.batteryholders.com/search.php?cat=Battery+Holder&num=&type=AA&term=; ComponentLink3Description: BHAA-POL-elitan; ComponentLink3URL: https://www.elitan.ru/price/item10505736; ComponentLink4Description: BHAA-3-G-elitan; ComponentLink4URL: https://www.elitan.ru/price/item10505735; ComponentLink5Description: EagTac 14500 750mAh 3А защищенный; ComponentLink5URL: https://www.lacrosse-nn.ru/%D0%B0%D0%BA%D0%BA%D1%83%D0%BC%D1%83%D0%BB%D1%8F%D1%82%D0%BE%D1%80%D1%8B-li-ion-14500-16340-rcr123/eagtac-14500-750mah-3a/; ComponentLink6Description: EAGTAC 750mAh защищенный; ComponentLink6URL: https://magzaryada.ru/akkumulyatory/14500-16340/eagletac-14500
X?#8 X?#12 = 390-021-12: Зажимной Клеммник 2-контактный, 5.0мм угловой DG390-5.0-02P (XY118-2P-05); ComponentLink1Description: chipdip; ComponentLink1URL: https://www.chipdip.ru/product/390-021-12?from=suggest_product; ComponentLink2Description: elitan; ComponentLink2URL: https://www.elitan.ru/price/item12230651
X?#9 = 16340 Battery Holder: 16340 Battery Holder with PC pins / Also Accepts: CR2/3A / Height above PCB: 15.1 mm; ComponentLink1Description: 6S-2/3A-elitan; ComponentLink1URL: https://www.elitan.ru/price/index.php?find=6S-2/3A&delay=-1&mfg=all&seenform=y; ComponentLink2Description: elitan_info; ComponentLink2URL: https://www.elitan.ru/price/item10994146; ComponentLink3Description: battery_holders; ComponentLink3URL: https://www.batteryholders.com/search.php?cat=Battery+Holder&num=&type=CR123A&term=&override=16340; ComponentLink4Description: 16340_750mAh_4.5A; ComponentLink4URL: https://magzaryada.ru/akkumulyatory/14500-16340/eagletac-16340-rcr123; ComponentLink5Description: EAGTAC 16340 / RCR123A 750mAh 4,5A защищенный; ComponentLink5URL: https://www.lacrosse-nn.ru/%D0%B0%D0%BA%D0%BA%D1%83%D0%BC%D1%83%D0%BB%D1%8F%D1%82%D0%BE%D1%80%D1%8B-li-ion-14500-16340-rcr123/eagtac-16340-750mah-4-5a/; ComponentLink6Description: 1029-elitan; ComponentLink6URL: https://www.elitan.ru/price/item468733
X?#10 = microJACK PY-401N: Гнездо моно 2.5мм
X?#11 = miniJACK PY-601N: Аудио гнездо (М) 3.5мм; ComponentLink1Description: chipdip; ComponentLink1URL: https://www.chipdip.ru/product/py-601n?from=suggest_product; ComponentLink2Description: elitan; ComponentLink2URL: https://www.elitan.ru/price/index.php?find=PY-601N&delay=-1&mfg=all&seenform=y